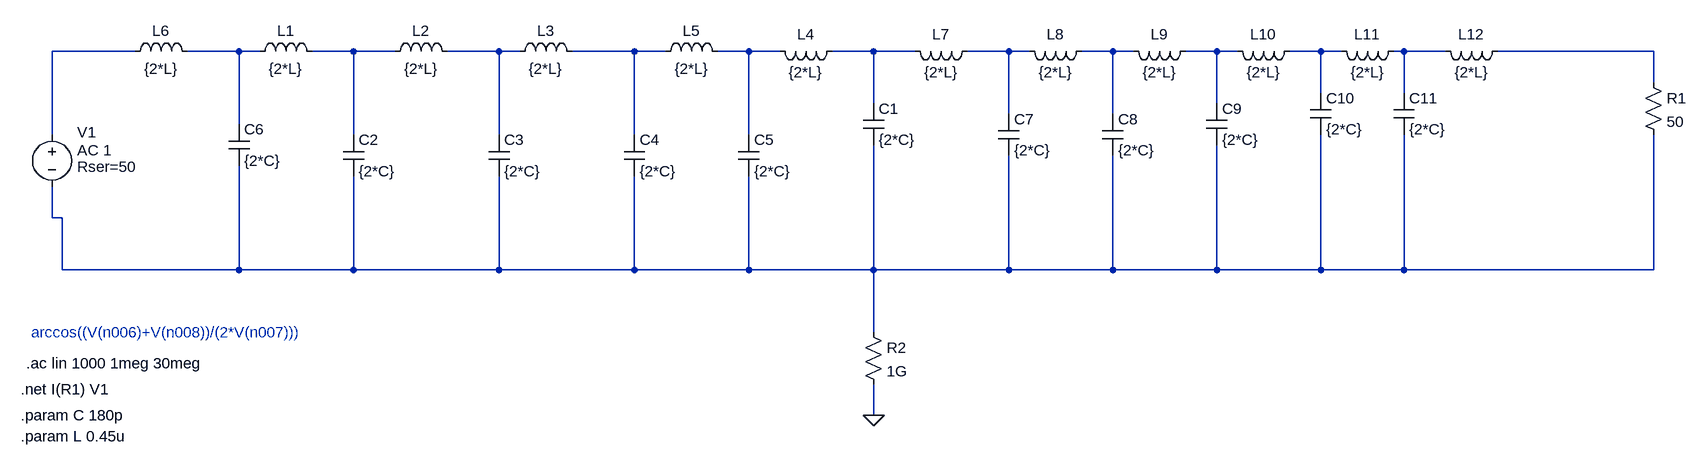
[diagram p0: schematic basicLC_ka.asc]
basicLC_ka.asc, the LTspice schematic file:
Version 4
SHEET 1 1324 680
WIRE -1488 -176 -1616 -176
WIRE -1328 -176 -1408 -176
WIRE -1296 -176 -1328 -176
WIRE -1152 -176 -1216 -176
WIRE -1088 -176 -1152 -176
WIRE -928 -176 -1008 -176
WIRE -896 -176 -928 -176
WIRE -720 -176 -816 -176
WIRE -672 -176 -720 -176
WIRE -544 -176 -592 -176
WIRE -496 -176 -544 -176
WIRE -352 -176 -416 -176
WIRE -288 -176 -352 -176
WIRE -144 -176 -208 -176
WIRE -112 -176 -144 -176
WIRE 16 -176 -32 -176
WIRE 48 -176 16 -176
WIRE 176 -176 128 -176
WIRE 208 -176 176 -176
WIRE 336 -176 288 -176
WIRE 368 -176 336 -176
WIRE 464 -176 448 -176
WIRE 528 -176 464 -176
WIRE 848 -176 608 -176
WIRE 848 -128 848 -176
WIRE 336 -112 336 -176
WIRE 464 -112 464 -176
WIRE -352 -96 -352 -176
WIRE 176 -96 176 -176
WIRE -144 -80 -144 -176
WIRE 16 -80 16 -176
WIRE -1328 -64 -1328 -176
WIRE -1616 -48 -1616 -176
WIRE -1152 -48 -1152 -176
WIRE -928 -48 -928 -176
WIRE -720 -48 -720 -176
WIRE -544 -48 -544 -176
WIRE -1616 80 -1616 32
WIRE -1600 80 -1616 80
WIRE -1600 160 -1600 80
WIRE -1328 160 -1328 0
WIRE -1328 160 -1600 160
WIRE -1152 160 -1152 16
WIRE -1152 160 -1328 160
WIRE -928 160 -928 16
WIRE -928 160 -1152 160
WIRE -720 160 -720 16
WIRE -720 160 -928 160
WIRE -544 160 -544 16
WIRE -544 160 -720 160
WIRE -352 160 -352 -32
WIRE -352 160 -544 160
WIRE -144 160 -144 -16
WIRE -144 160 -352 160
WIRE 16 160 16 -16
WIRE 16 160 -144 160
WIRE 176 160 176 -32
WIRE 176 160 16 160
WIRE 336 160 336 -48
WIRE 336 160 176 160
WIRE 464 160 464 -48
WIRE 464 160 336 160
WIRE 848 160 848 -48
WIRE 848 160 464 160
WIRE -352 256 -352 160
WIRE -352 384 -352 336
FLAG -352 384 0
SYMBOL voltage -1616 -64 R0
WINDOW 0 39 12 Left 2
WINDOW 123 39 40 Left 2
WINDOW 39 39 65 Left 2
SYMATTR InstName V1
SYMATTR Value2 AC 1
SYMATTR SpiceLine Rser=50
SYMATTR Value ""
SYMBOL ind -1312 -160 R270
WINDOW 0 32 56 VTop 2
WINDOW 3 5 56 VBottom 2
SYMATTR InstName L1
SYMATTR Value {2*L}
SYMBOL ind -1104 -160 R270
WINDOW 0 32 56 VTop 2
WINDOW 3 5 56 VBottom 2
SYMATTR InstName L2
SYMATTR Value {2*L}
SYMBOL ind -912 -160 R270
WINDOW 0 32 56 VTop 2
WINDOW 3 5 56 VBottom 2
SYMATTR InstName L3
SYMATTR Value {2*L}
SYMBOL ind -688 -160 R270
WINDOW 0 32 56 VTop 2
WINDOW 3 5 56 VBottom 2
SYMATTR InstName L5
SYMATTR Value {2*L}
SYMBOL res 832 -144 R0
SYMATTR InstName R1
SYMATTR Value 50
SYMBOL cap -1168 -48 R0
SYMATTR InstName C2
SYMATTR Value {2*C}
SYMBOL cap -944 -48 R0
SYMATTR InstName C3
SYMATTR Value {2*C}
SYMBOL cap -736 -48 R0
SYMATTR InstName C4
SYMATTR Value {2*C}
SYMBOL cap -560 -48 R0
SYMATTR InstName C5
SYMATTR Value {2*C}
SYMBOL cap -368 -96 R0
SYMATTR InstName C1
SYMATTR Value {2*C}
SYMBOL ind -400 -192 R90
WINDOW 0 5 56 VBottom 2
WINDOW 3 32 56 VTop 2
SYMATTR InstName L4
SYMATTR Value {2*L}
SYMBOL ind -192 -192 R90
WINDOW 0 5 56 VBottom 2
WINDOW 3 32 56 VTop 2
SYMATTR InstName L7
SYMATTR Value {2*L}
SYMBOL ind -16 -192 R90
WINDOW 0 5 56 VBottom 2
WINDOW 3 32 56 VTop 2
SYMATTR InstName L8
SYMATTR Value {2*L}
SYMBOL ind 144 -192 R90
WINDOW 0 5 56 VBottom 2
WINDOW 3 32 56 VTop 2
SYMATTR InstName L9
SYMATTR Value {2*L}
SYMBOL ind 304 -192 R90
WINDOW 0 5 56 VBottom 2
WINDOW 3 32 56 VTop 2
SYMATTR InstName L10
SYMATTR Value {2*L}
SYMBOL ind 464 -192 R90
WINDOW 0 5 56 VBottom 2
WINDOW 3 32 56 VTop 2
SYMATTR InstName L11
SYMATTR Value {2*L}
SYMBOL cap -1344 -64 R0
SYMATTR InstName C6
SYMATTR Value {2*C}
SYMBOL cap -160 -80 R0
SYMATTR InstName C7
SYMATTR Value {2*C}
SYMBOL cap 0 -80 R0
SYMATTR InstName C8
SYMATTR Value {2*C}
SYMBOL cap 160 -96 R0
SYMATTR InstName C9
SYMATTR Value {2*C}
SYMBOL cap 320 -112 R0
SYMATTR InstName C10
SYMATTR Value {2*C}
SYMBOL cap 448 -112 R0
SYMATTR InstName C11
SYMATTR Value {2*C}
SYMBOL res -368 240 R0
SYMATTR InstName R2
SYMATTR Value 1G
SYMBOL ind -1504 -160 R270
WINDOW 0 32 56 VTop 2
WINDOW 3 5 56 VBottom 2
SYMATTR InstName L6
SYMATTR Value {2*L}
SYMBOL ind 624 -192 R90
WINDOW 0 5 56 VBottom 2
WINDOW 3 32 56 VTop 2
SYMATTR InstName L12
SYMATTR Value {2*L}
TEXT -1664 344 Left 2 !.net I(R1) V1
TEXT -1664 384 Left 2 !.param C 180p
TEXT -1664 416 Left 2 !.param L 0.45u
TEXT -1656 304 Left 2 !.ac lin 1000 1meg 30meg
TEXT -1648 256 Left 2 ;arccos((V(n006)+V(n008))/(2*V(n007)))

The netlist it stands for:
* basicLC_ka.asc
V1 N001 N014 AC 1 Rser=50
L1 N002 N003 {2*L}
L2 N003 N004 {2*L}
L3 N004 N005 {2*L}
L5 N005 N006 {2*L}
R1 N013 N014 50
C2 N003 N014 {2*C}
C3 N004 N014 {2*C}
C4 N005 N014 {2*C}
C5 N006 N014 {2*C}
C1 N007 N014 {2*C}
L4 N007 N006 {2*L}
L7 N008 N007 {2*L}
L8 N009 N008 {2*L}
L9 N010 N009 {2*L}
L10 N011 N010 {2*L}
L11 N012 N011 {2*L}
C6 N002 N014 {2*C}
C7 N008 N014 {2*C}
C8 N009 N014 {2*C}
C9 N010 N014 {2*C}
C10 N011 N014 {2*C}
C11 N012 N014 {2*C}
R2 N014 0 1G
L6 N001 N002 {2*L}
L12 N013 N012 {2*L}
.net I(R1) V1
.param C 180p
.param L 0.45u
.ac lin 1000 1meg 30meg
* arccos((V(n006)+V(n008))/(2*V(n007)))
.backanno
.end